# EAGLE design Rocketometer2148 LSM330DLC (EAGLE 6.2)
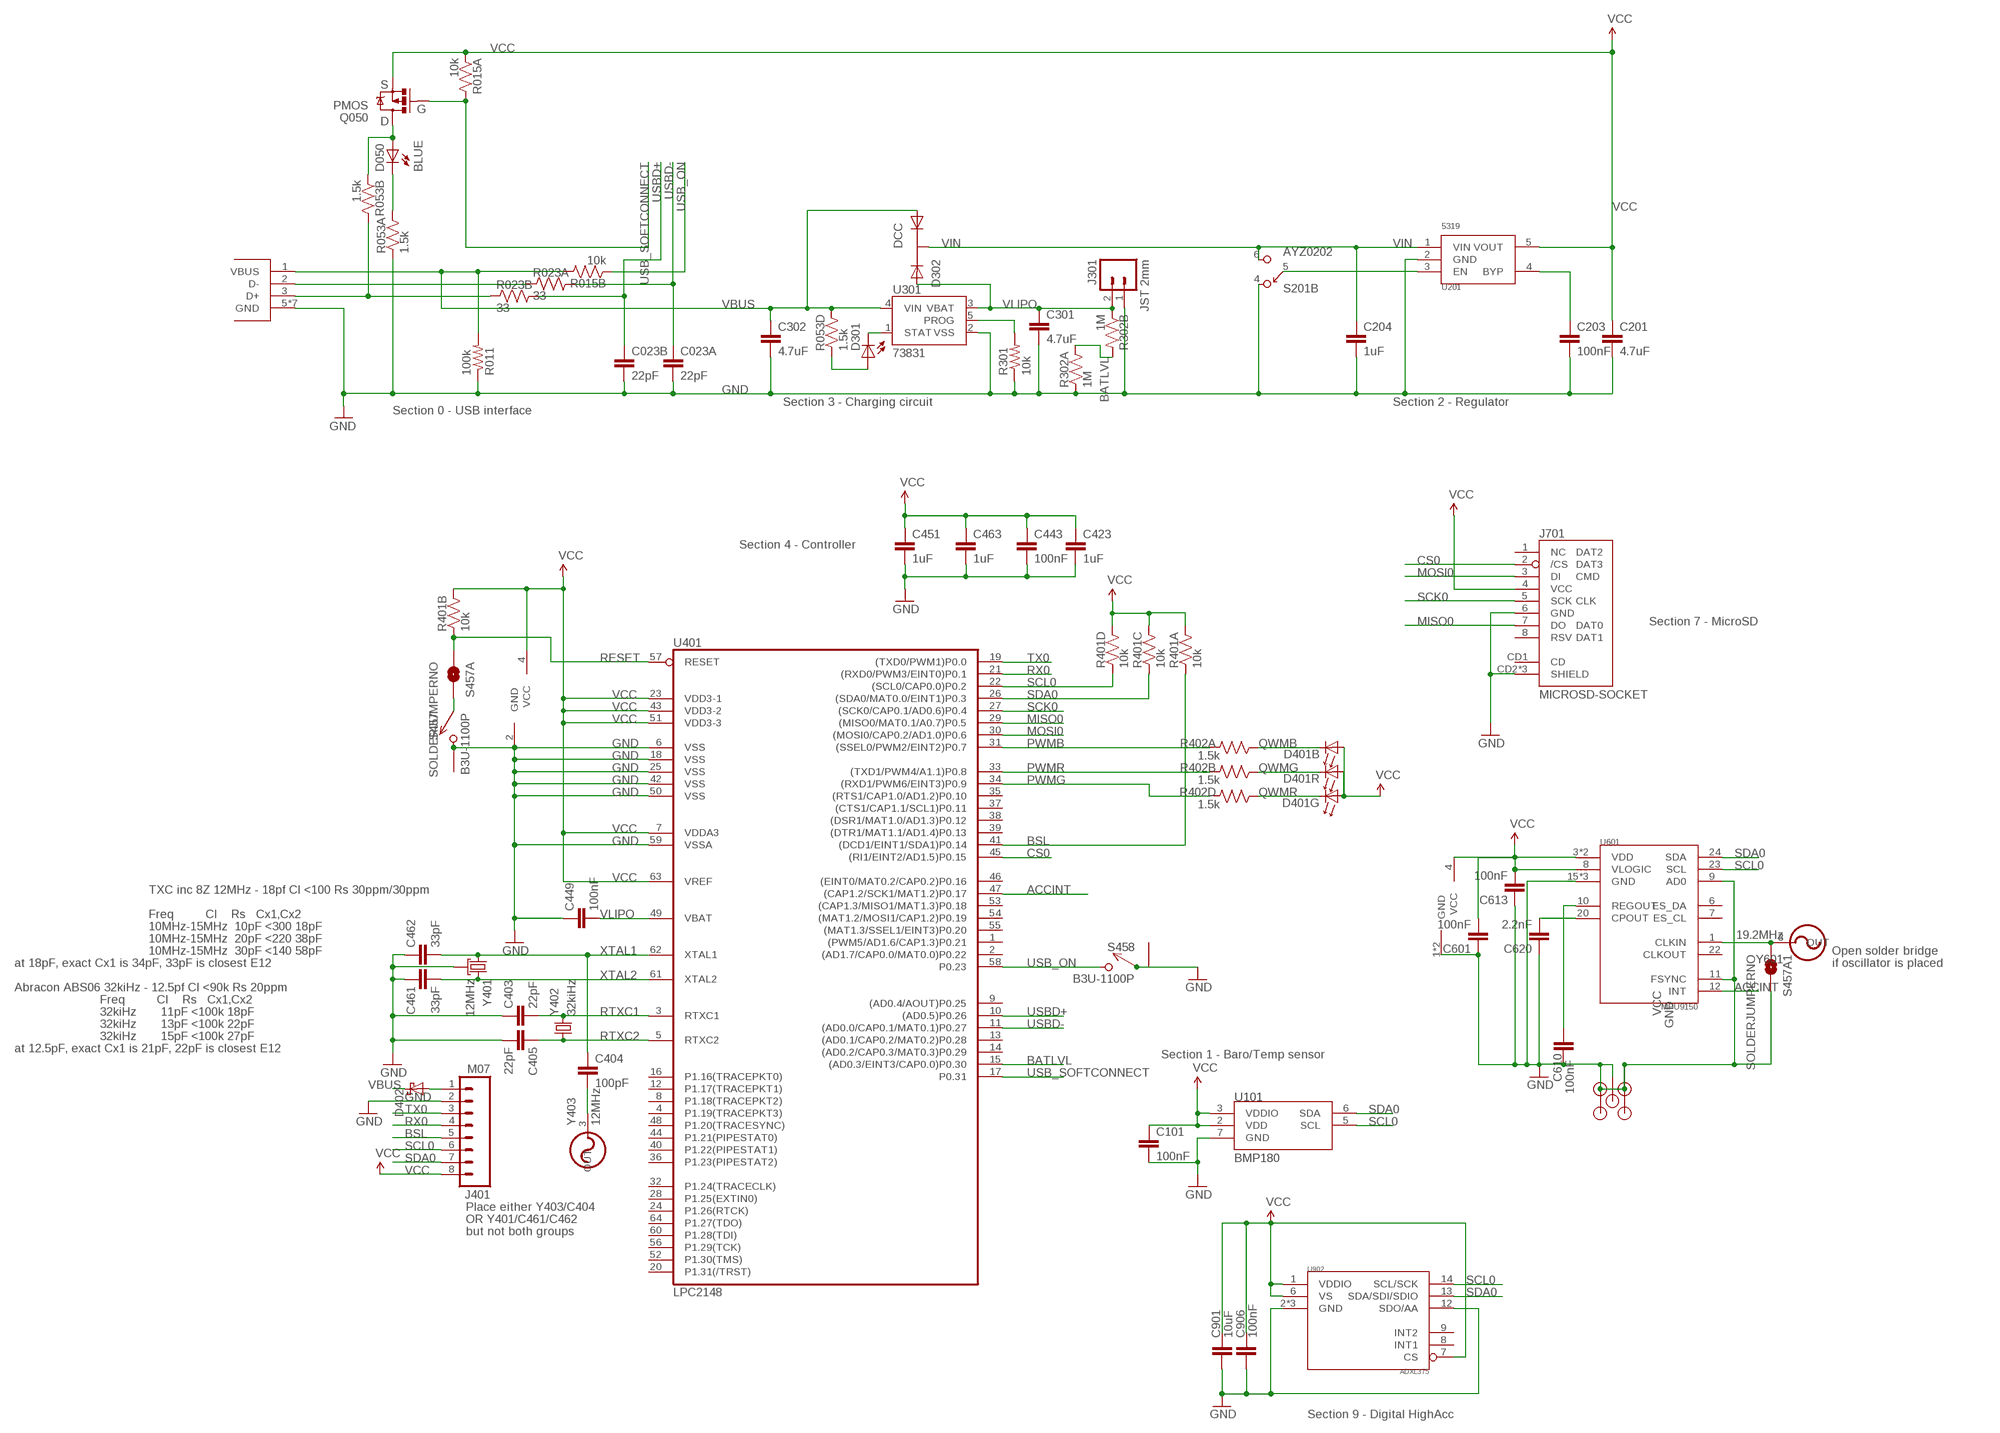
[diagram p0: schematic, sheet 1]

## Parts
C023  22pF  CKCM25  [CKCM25]
C101  100nF  CAP0402-CAP  [0402-CAP]
C201  4.7uF  CAP0402-CAP  [0402-CAP]
C203  100nF  CAP0402-CAP  [0402-CAP]
C204  1uF  CAP0402-CAP  [0402-CAP]
C301  4.7uF  CAP0402-CAP  [0402-CAP]
C302  4.7uF  CAP0402-CAP  [0402-CAP]
C403  22pF  CAP0402-CAP  [0402-CAP]
C404  100pF  CAP0402-CAP  [0402-CAP]
C405  22pF  CAP0402-CAP  [0402-CAP]
C423  1uF  CAP0402-CAP  [0402-CAP]
C443  100nF  CAP0402-CAP  [0402-CAP]
C449  100nF  CAP0402-CAP  [0402-CAP]
C451  1uF  CAP0402-CAP  [0402-CAP]
C461  33pF  CAP0402-CAP  [0402-CAP]
C462  33pF  CAP0402-CAP  [0402-CAP]
C463  1uF  CAP0402-CAP  [0402-CAP]
C601  100nF  CAP0402-CAP  [0402-CAP]
C610  100nF  CAP0402-CAP  [0402-CAP]
C613  100nF  CAP0402-CAP  [0402-CAP]
C620  2.2nF  CAP0402-CAP  [0402-CAP]
C901  10uF  CAP0603-CAP  [0603-CAP]
C906  100nF  CAP0402-CAP  [0402-CAP]
D050  BLUE  LED0603  [LED-0603]
D301  YELLOW  LED0603  [LED-0603]
D302  DCC  PMEG2005CT  [SOT-23-3]
D401  SMLP36RGB2W(R)  [SMLP36]
D402  DIODE_SCHOTTKY  [D0603]
J001  USB_MICROB_JSTGCT  [USB_MICROB_3075]
J301  JST 2mm  M02-JST-2MM-SMT  [JST-2-SMD]
J401  M07  M081X08  [1X08]
J701  MICROSD-SOCKET  [MICROSD-SOCKET-PP]
JP1  STANDOFF  [STANDOFF]
JP2  STANDOFF  [STANDOFF]
JP3  STANDOFF  [STANDOFF]
JP4  STANDOFF  [STANDOFF]
JP5  STANDOFF  [STANDOFF]
Q050  PMOS  MOSFET-PCHANNELSMD  [SOT23-3]
R011  100k  RESISTOR0402-RES  [0402-RES]
R015  10k  RP2EXB24V  [CRA02]
R023  33  RP2EXB24V  [CRA02]
R053  1.5k  RP404  [CRA04]
R301  10k  RESISTOR0402-RES  [0402-RES]
R302  1M  RP2EXB24V  [CRA02]
R401  10k  RP404  [CRA04]
R402  1.5k  RP404  [CRA04]
S201  AYZ0202  [AYZ0202]
S457  B3U-1100P  [B3U-1100P]
S457A  SOLDERJUMPERNO  [SJ_2S-NO]
S457A1  SOLDERJUMPERNO  [SJ_2S-NO]
S458  B3U-1100P  [B3U-1100P]
U101  BMP180  [BMP180]
U201  5319  MIC5319D5  [SOT-23-5]
U301  73831  MCP73831  [SOT23-5]
U401  LPC2148  LPC213X  [SQFP-S-10X10-64]
U601  MPU9150  [LLGA24]
U902  ADXL375  [ADXL375]
Y401  12MHz  CX2520  [CRYSTAL_SMD_2MM_2_5MM]
Y402  32kiHz  ABS06  [ABS06]
Y403  12MHz  OSCILLATORE35MT  [CRYSTAL_SMD_5MM_3_2MM]
Y601  19.2MHz  OSCILLATORASDMB  [CRYSTAL_SMD_2MM_2_5MM]

## Nets
ACCINT: U401.47((CAP1.2/SCK1/MAT1.2)P0.17) U601.12(INT)
BATLVL: R302.3 R302.4 U401.15((AD0.3/EINT3/CAP0.0)P0.30)
BSL: J401.5 R401.1 U401.41((DCD1/EINT1/SDA1)P0.14)
CONN_D+: J001.3(D+) R023.2 R053.7
CONN_D-: J001.2(D-) R023.1
CS0: J701.2(/CS) U401.45((RI1/EINT2/AD1.5)P0.15)
EN: S201.5 U201.3(EN)
GND [power]: C023.3 C023.4 C101.2 C201.2 C203.2 C204.2 C301.2 C302.2 C403.1 C405.2 C423.2 C443.2 C449.1 C451.2 C461.1 C462.1 C463.2 C601.1 C610.2 C613.1 C620.1 C901.2 C906.2 J001.5(GND) J001.P$1(GND) J001.P$2(GND) J001.P$3(GND) J001.P$4(GND) J001.P$8(GND) J001.P$10(GND) J301.1 J401.2 J701.6(GND) J701.CD2(SHIELD) J701.GND1(SHIELD) J701.GND3(SHIELD) JP1.P$1 JP2.P$1 JP3.P$1 JP4.P$1 JP5.P$1 R011.1 R053.1 R301.1 R302.1 S201.4 S457.P$2 S457.P$3 S457A1.2 S458.P$1 S458.P$3 U101.7(GND) U201.2(GND) U301.2(VSS) U401.6(VSS) U401.18(VSS) U401.25(VSS) U401.42(VSS) U401.50(VSS) U401.59(VSSA) U601.9(AD0) U601.11(FSYNC) U601.15(GND) U601.17(GND) U601.18(GND) U902.2(GND) U902.4(GND) U902.5(GND) U902.12(SDO/AA) Y401.2(GND) Y401.4(GND) Y403.2(GND) Y601.1(GND) Y601.2(GND)
MISO0: J701.7(DO) U401.29((MISO0/MAT0.1/A0.7)P0.5)
MOSI0: J701.3(DI) U401.30((MOSI0/CAP0.2/AD1.0)P0.6)
N$1: C620.2 U601.20(CPOUT)
N$2: R301.2 U301.5(PROG)
N$3: D301.A R053.4
N$4: D301.C U301.1(STAT)
N$5: C404.2 Y403.3(OUT)
N$6: D050.A Q050.3(D) R053.2
N$7: D050.C R053.8
N$8 [power]: D402.A J401.1
N$9 [power]: S457.P$1 S457A.2
N$13: C610.1 U601.10(REGOUT)
N$17: C203.1 U201.4(BYP)
OSC_9DOF: S457A1.1 U601.1(CLKIN) Y601.3(OUT)
PWMB: R402.8 U401.31((SSEL0/PWM2/EINT2)P0.7)
PWMG: R402.5 U401.34((RXD1/PWM6/EINT3)P0.9)
PWMR: R402.7 U401.33((TXD1/PWM4/A1.1)P0.8)
QWMB: D401.1(B:C) R402.1
QWMG: D401.5(G:C) R402.4
QWMR: D401.3(R:C) R402.2
RESET [power]: R401.2 S457A.1 U401.57(RESET)
RTXC1: C403.2 U401.3(RTXC1) Y402.2
RTXC2: C405.1 U401.5(RTXC2) Y402.1
RX0: J401.4 U401.21((RXD0/PWM3/EINT0)P0.1)
SCK0: J701.5(SCK) U401.27((SCK0/CAP0.1/AD0.6)P0.4)
SCL0: J401.6 R401.4 U101.5(SCL) U401.22((SCL0/CAP0.0)P0.2) U601.23(SCL) U902.14(SCL/SCK)
SDA0: J401.7 R401.3 U101.6(SDA) U401.26((SDA0/MAT0.0/EINT1)P0.3) U601.24(SDA) U902.13(SDA/SDI/SDIO)
TX0: J401.3 U401.19((TXD0/PWM1)P0.0)
USB_ON: R015.2 S458.P$2 U401.58(P0.23)
USB_SOFTCONNECT: Q050.1(G) R015.4 U401.17(P0.31)
USBD+: C023.2 R023.3 U401.10((AD0.5)P0.26)
USBD-: C023.1 R023.4 U401.11((AD0.0/CAP0.1/MAT0.1)P0.27)
VBUS [power]: C302.1 D302.1(A1) D402.C(K) J001.1(VBUS) R011.2 R015.3 R053.5 U301.4(VIN)
VCC [power]: C101.1 C201.1 C423.1 C443.1 C451.1 C463.1 C601.2 C613.2 C901.1 C906.1 D401.2(B:A) D401.4(R:A) D401.6(G:A) J401.8 J701.4(VCC) Q050.2(S) R015.1 R401.5 R401.6 R401.7 R401.8 U101.2(VDD) U101.3(VDDIO) U201.5(VOUT) U401.7(VDDA3) U401.23(VDD3-1) U401.43(VDD3-2) U401.51(VDD3-3) U401.63(VREF) U601.3(VDD) U601.8(VLOGIC) U601.13(VDD) U902.1(VDDIO) U902.6(VS) U902.7(CS) Y403.4(VCC) Y601.4(VCC)
VIN: C204.1 D302.3(K) S201.6 U201.1(VIN)
VLIPO [power]: C301.1 C449.2 D302.2(A2) J301.2 R302.2 U301.3(VBAT) U401.49(VBAT)
XTAL1: C404.1 C462.2 U401.62(XTAL1) Y401.1
XTAL2: C461.2 U401.61(XTAL2) Y401.3
Unconnected: J701.1(NC) J701.8(RSV) J701.CD1(CD) R053.3 R053.6 R402.3 R402.6 S201.1 S201.2 S201.3 U401.1((PWM5/AD1.6/CAP1.3)P0.21) U401.2((AD1.7/CAP0.0/MAT0.0)P0.22) U401.4(P1.19(TRACEPKT3)) U401.8(P1.18(TRACEPKT2)) U401.9((AD0.4/AOUT)P0.25) U401.12(P1.17(TRACEPKT1)) U401.13((AD0.1/CAP0.2/MAT0.2)P0.28) U401.14((AD0.2/CAP0.3/MAT0.3)P0.29) U401.16(P1.16(TRACEPKT0)) U401.20(P1.31(/TRST)) U401.24(P1.26(RTCK)) U401.28(P1.25(EXTIN0)) U401.32(P1.24(TRACECLK)) U401.35((RTS1/CAP1.0/AD1.2)P0.10) U401.36(P1.23(PIPESTAT2)) U401.37((CTS1/CAP1.1/SCL1)P0.11) U401.38((DSR1/MAT1.0/AD1.3)P0.12) U401.39((DTR1/MAT1.1/AD1.4)P0.13) U401.40(P1.22(PIPESTAT1)) U401.44(P1.21(PIPESTAT0)) U401.46((EINT0/MAT0.2/CAP0.2)P0.16) U401.48(P1.20(TRACESYNC)) U401.52(P1.30(TMS)) U401.53((CAP1.3/MISO1/MAT1.3)P0.18) U401.54((MAT1.2/MOSI1/CAP1.2)P0.19) U401.55((MAT1.3/SSEL1/EINT3)P0.20) U401.56(P1.29(TCK)) U401.60(P1.28(TDI)) U401.64(P1.27(TDO)) U601.6(ES_DA) U601.7(ES_CL) U601.22(CLKOUT) U902.8(INT1) U902.9(INT2)

## Notes on the sheet
- S
- G
- D
- Section 0 - USB interface | Section 3 - Charging circuit | Section 2 - Regulator
- Section 4 - Controller
- Section 7 - MicroSD
- TXC inc 8Z 12MHz - 18pf Cl <100 Rs 30ppm/30ppm
- Freq         Cl    Rs   Cx1,Cx2
- 10MHz-15MHz  10pF <300 18pF
- 10MHz-15MHz  20pF <220 38pF
- 10MHz-15MHz  30pF <140 58pF | Open solder bridge
- at 18pF, exact Cx1 is 34pF, 33pF is closest E12 | if oscillator is placed
- Abracon ABS06 32kiHz - 12.5pf Cl <90k Rs 20ppm
- Freq         Cl    Rs   Cx1,Cx2
- 32kiHz       11pF <100k 18pF
- 32kiHz       13pF <100k 22pF
- 32kiHz       15pF <100k 27pF
- at 12.5pF, exact Cx1 is 21pF, 22pF is closest E12
- Section 1 - Baro/Temp sensor
- Place either Y403/C404
- OR Y401/C461/C462
- but not both groups
- Section 9 - Digital HighAcc

## Library data of the parts
C023 = KwanSystems:CKC; DIGIKEY: 445-1860-1-ND
C101 C203 C443 C449 C601 C610 C613 = SparkFun:CAP: Capacitor Standard 0603 ceramic capacitor, and 0.1" leaded capacitor.; DIGIKEY: 445-1265-1-ND
C201 C301 C302 = SparkFun:CAP: Capacitor Standard 0603 ceramic capacitor, and 0.1" leaded capacitor.; DIGIKEY: 445-7395-1-ND
C204 C423 C451 C463 = SparkFun:CAP: Capacitor Standard 0603 ceramic capacitor, and 0.1" leaded capacitor.; DIGIKEY: 445-4114-1-ND
C403-C405 = SparkFun:CAP: Capacitor Standard 0603 ceramic capacitor, and 0.1" leaded capacitor.; DIGIKEY: 445-1239-1-ND
C461 C462 = SparkFun:CAP: Capacitor Standard 0603 ceramic capacitor, and 0.1" leaded capacitor.; DIGIKEY: 445-1241-1-ND
C620 = SparkFun:CAP: Capacitor Standard 0603 ceramic capacitor, and 0.1" leaded capacitor.; DIGIKEY: 445-1257-1-ND
C901 = SparkFun:CAP: Capacitor Standard 0603 ceramic capacitor, and 0.1" leaded capacitor.; DIGIKEY: 445-7486-1-ND
C906 = SparkFun-Passives:CAP: Capacitor Standard 0603 ceramic capacitor, and 0.1" leaded capacitor.; DIGIKEY: 445-1265-1-ND
D050 = SparkFun:LED: LEDs Standard schematic elements and footprints for 5mm, 3mm, 1206, and 0603 sized LEDs. 5mm - Spark Fun Electronics SKU : COM-00529 (and others); DIGIKEY: 350-2037-1-ND
D301 = SparkFun:LED: LEDs Standard schematic elements and footprints for 5mm, 3mm, 1206, and 0603 sized LEDs. 5mm - Spark Fun Electronics SKU : COM-00529 (and others); DIGIKEY: 350-2032-1-ND
D302 = KwanSystems:PMEG2005CT; DIGIKEY: 568-6500-1-ND
D401 = KwanSystems:SMLP36RGB2W(R); DIGIKEY: 846-1097-1-ND
D402 = KwanSystems:DIODE_SCHOTTKY
J001 = KwanSystems:USB_MICROB_JST; DIGIKEY: 609-4616-2-ND
J301 = SparkFun:M02: Header 2 Standard 2-pin 0.1" header. Use with straight break away headers (SKU : PRT-00116), right angle break away headers (PRT-00553), swiss pins (PRT-00743), machine pins (PRT-00117), and female headers (PRT-00115). Molex polarized connector foot print use with SKU : PRT-08233 with associated crimp pins and housings.; DIGIKEY: 455-1749-1-ND
J401 = SparkFun-Connectors:M08: Header 8 Standard 8-pin 0.1" header. Use with straight break away headers (SKU : PRT-00116), right angle break away headers (PRT-00553), swiss pins (PRT-00743), machine pins (PRT-00117), and female headers (PRT-00115).; DIGIKEY: $NOPART
J701 = KwanSystems:MICROSD-SOCKET: microSD Socket Push-push type uSD socket. Digikey 101-00660-68-6-1-ND. tDoc lines correctly indicate media card edge positions when inserting (unlocked, locked, depressed).; DIGIKEY: 101-00581-59-1-ND
JP1-JP5 = KwanSystems:STANDOFF; DIGIKEY: $NOPART
Q050 = SparkFun:MOSFET-PCHANNEL; DIGIKEY: NTR1P02T1GOSCT-ND
R011 = SparkFun:RESISTOR: Resistor Basic schematic elements and footprints for 0603, 1206, and PTH resistors.; DIGIKEY: P100KLCT-ND
R015 = KwanSystems:RP2; DIGIKEY: Y5103CT-ND
R023 R302 = KwanSystems:RP2
R053 R402 = KwanSystems:RP4; DIGIKEY: CRA4S81.5KCT-ND
R301 = SparkFun:RESISTOR: Resistor Basic schematic elements and footprints for 0603, 1206, and PTH resistors.; DIGIKEY: P10.0KLCT-ND
R401 = KwanSystems:RP4; DIGIKEY: CRA4S810KCT-ND
S201 = KwanSystems:AYZ0202; DIGIKEY: 401-2013-1-ND
S457 S458 = KwanSystems:B3U-1100P; DIGIKEY: SW1021CT-ND
S457A S457A1 = SparkFun-Passives:SOLDERJUMPER: Solder Jumper Standard SMD solder jumper. Used to automate production. Two varients : Normally Open and Normally Closed are the same, but have different paste layers. NC will have a large amount of paste and should jumper during reflow.; DIGIKEY: $NOPART
U101 = KwanSystems:BMP180; DIGIKEY: 828-1027-1-ND
U201 = KwanSystems:MIC5319; DIGIKEY: 576-1910-1-ND
U301 = SparkFun:MCP73831: Microchip's MCP73831 Miniature single cell, fully integrated Li-Ion, Li-polymer charge management controller http://ww1.microchip.com/downloads/en/DeviceDoc/21984a.pdf; DIGIKEY: MCP73831T-2ACI/OTCT-ND
U401 = SparkFun:LPC213X: LPC213x Schematic element and footprint for NXP LPC213x. Spark Fun Electronics SKU : COM-00520; DIGIKEY: 568-1765-ND
U601 = KwanSystems:MPU9150; DIGIKEY: $NOPART
U902 = KwanSystems:ADXL375; DIGIKEY: ADXL375BCCZ-ND
Y401 = KwanSystems:CX2520; DIGIKEY: 887-1487-1-ND
Y402 = KwanSystems:ABS06; DIGIKEY: 535-10104-1-ND
Y403 = KwanSystems:OSCILLATOR: EM53T temperature compensated oscillator (TCXO) This part contains a crystal and all the rest of the electronics needed to directly produce a clock signal. Temperature compensation means that the part maintains +-2ppm over a wide temperature range.; DIGIKEY: 631-1068-1-ND
Y601 = KwanSystems:OSCILLATOR: EM53T temperature compensated oscillator (TCXO) This part contains a crystal and all the rest of the electronics needed to directly produce a clock signal. Temperature compensation means that the part maintains +-2ppm over a wide temperature range.

## Net classes
0 default: width 0.152 mm, drill 0.33 mm, clearance 0.152 mm
1 power: width 0.152 mm, drill 0.33 mm, clearance 0.152 mm to class 0, clearance 0.152 mm
2 hv: width 0.152 mm, drill 0.33 mm, clearance 0.152 mm to class 0, clearance 0.152 mm to class 1, clearance 0.152 mm

## Board
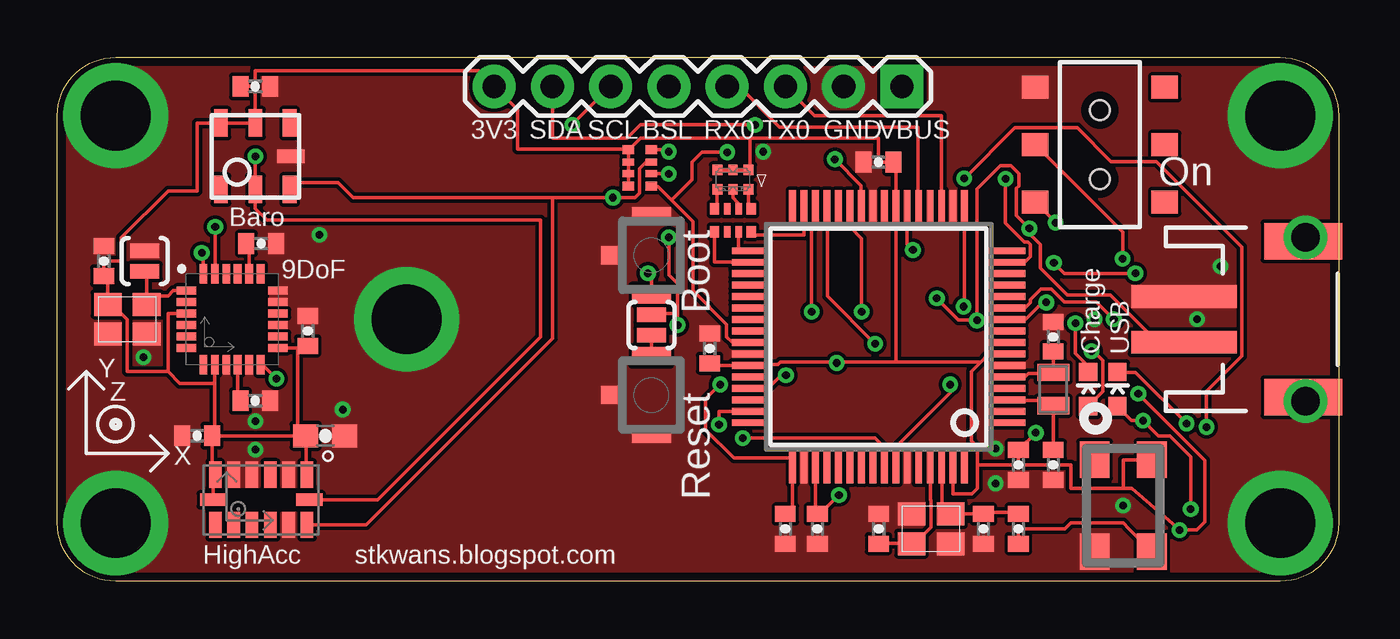
[diagram p1: board, top side]
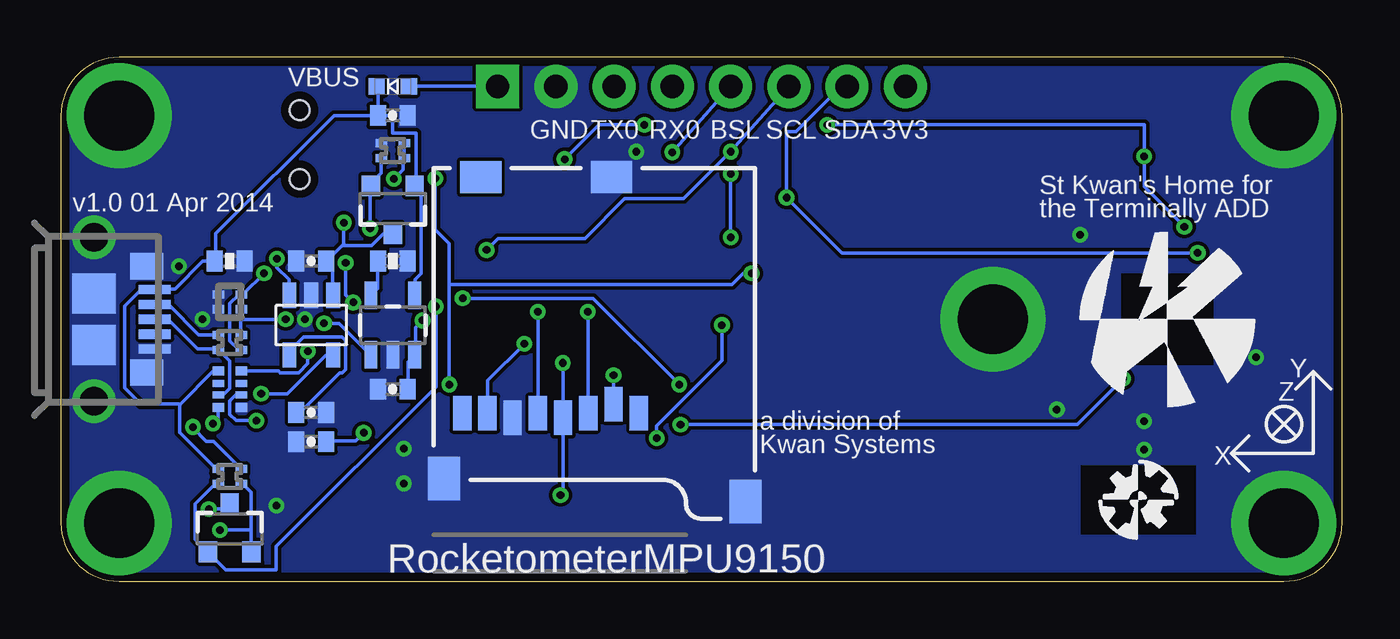
[diagram p2: board, bottom side, seen from below]

Size 55.88 x 22.86 mm. Coordinates in mm from the lower left corner, seen from the top.
Outline: 2.54,22.86 53.34,22.86 arc-90 55.88,20.32 55.88,2.54 arc-90 53.34,0 2.54,0 arc-90 0,2.54 0,20.32 arc-90 2.54,22.86
Copper layers (1*16): Top 0.0356mm / dielectric 1.5011mm / Bottom 0.0356mm
Design rules: minimum track width 6mil, minimum drill 13mil, track to track 6mil, track to pad 6mil, pad to pad 6mil, via to via 6mil, smd to smd 6mil, copper to edge 15mil, drill to drill 6mil, minimum pad ring 7mil, minimum via ring 7mil, stop-mask expansion 4mil, vias tented up to drill 14mil, thermal gap 10mil

### Footprints (pad centres in the part's own frame; a part is rotated, then mirrored left to right if it is on the bottom)
CKCM25 = smd 0.35 x 0.5: 1 -0.325,-0.5; 2 0.325,-0.5; 3 0.325,0.5; 4 -0.325,0.5
0402-CAP = smd 0.7 x 0.9: 1 -0.65,0; 2 0.65,0
0603-CAP = smd 1.1 x 1: 1 -0.85,0; 2 0.85,0
LED-0603 = smd 0.8 x 0.8: A 0,-0.75; C 0,0.75
SOT-23-3 = smd 0.9 x 0.8: 1 -1,0.95; 2 -1,-0.95; 3 1.1,0
SMLP36 = smd 0.45 x 0.45: 1 -0.675,0.425; 2 -0.675,-0.425; 5 0.675,0.425; 6 0.675,-0.425 | smd 0.4 x 0.45: 3 0,0.425; 4 0,-0.425
D0603 = smd 0.7 x 0.7: A -0.7,0; C 0.7,0
USB_MICROB_3075 = smd 0.4 x 1.4: 1 -1.3,4.1; 2 -0.65,4.1; 3 0,4.1; 4 0.65,4.1; 5 1.3,4.1 | smd 1.15 x 1.45: P$1 2.32,3.75; P$10 -2.32,3.75 | smd 1.75 x 1.9: P$2 1.125,1.45; P$8 -1.125,1.45 | drill 1.25 pad 1.9: P$3 -3.575,1.45; P$4 3.575,1.45
JST-2-SMD = smd 1 x 4.6: 1 -1,-3.7; 2 1,-3.7 | smd 1.6 x 3.4: NC1 -3.4,1.5; NC2 3.4,1.5
1X08 = drill 1.016 pad 1.88 square: 1 0,0 | drill 1.016 pad 1.88: 2 2.54,0; 3 5.08,0; 4 7.62,0; 5 10.16,0; 6 12.7,0; 7 15.24,0; 8 17.78,0
MICROSD-SOCKET-PP = smd 0.8 x 1.5: 1 -8.94,10.7; 2 -7.84,10.3; 3 -6.74,10.7; 4 -5.64,10.9; 5 -4.54,10.7; 6 -3.44,10.9; 7 -2.34,10.7; 8 -1.24,10.7 | smd 1.8 x 1.4: CD1 -2.05,0.4; CD2 -7.75,0.4 | smd 1.4 x 1.9: GND1 -13.6,14.55; GND3 -0.45,13.55
STANDOFF = drill 3.048 pad 4.572: P$1 0,0
SOT23-3 = smd 0.8 x 0.9: 1 -0.95,-1; 2 0.95,-1; 3 0,1.1
0402-RES = smd 0.7 x 0.9: 1 -0.65,0; 2 0.65,0
CRA02 = smd 0.35 x 0.5: 1 -0.325,-0.5; 2 0.325,-0.5; 3 0.325,0.5; 4 -0.325,0.5
CRA04 = smd 0.4 x 0.5: 1 -0.8,-0.5; 4 0.8,-0.5; 5 0.8,0.5; 8 -0.8,0.5 | smd 0.3 x 0.5: 2 -0.25,-0.5; 3 0.25,-0.5; 6 0.25,0.5; 7 -0.25,0.5
AYZ0202 = smd 1 x 1.15: 1 -2.5,2.825; 2 0,2.825; 3 2.5,2.825; 4 -2.5,-2.825; 5 0,-2.825; 6 2.5,-2.825 | hole 0.85: 1.5,0; -1.5,0
B3U-1100P = smd 0.8 x 1.7: P$1 -1.7,0; P$2 1.7,0 | smd 0.8 x 1.1: P$3 0,-1.65
SJ_2S-NO = smd 0.635 x 1.27: 1 -0.45,0; 2 0.45,0
BMP180 = smd 0.6 x 1.2: 1 1.5,1.45; 2 0,1.45; 3 -1.5,1.45; 4 -1.5,-1.45; 5 0,-1.45; 6 1.5,-1.45 | smd 1.2 x 0.6: 7 1.55,0
SOT-23-5 = smd 0.6 x 1.1: 1 -0.95,-1.3; 2 0,-1.3; 3 0.95,-1.3; 4 0.95,1.3; 5 -0.95,1.3
SOT23-5 = smd 0.55 x 1.2: 1 -0.95,-1.3; 2 0,-1.3; 3 0.95,-1.3; 4 0.95,1.3; 5 -0.95,1.3
SQFP-S-10X10-64 = smd 0.3 x 1.6: 1 -3.75,-5.6; 2 -3.25,-5.6; 3 -2.75,-5.6; 4 -2.25,-5.6; 5 -1.75,-5.6; 6 -1.25,-5.6; 7 -0.75,-5.6; 8 -0.25,-5.6; 9 0.25,-5.6; 10 0.75,-5.6; 11 1.25,-5.6; 12 1.75,-5.6; 13 2.25,-5.6; 14 2.75,-5.6; 15 3.25,-5.6; 16 3.75,-5.6; 33 3.75,5.6; 34 3.25,5.6; 35 2.75,5.6; 36 2.25,5.6; 37 1.75,5.6; 38 1.25,5.6; 39 0.75,5.6; 40 0.25,5.6; 41 -0.25,5.6; 42 -0.75,5.6; 43 -1.25,5.6; 44 -1.75,5.6; 45 -2.25,5.6; 46 -2.75,5.6; 47 -3.25,5.6; 48 -3.75,5.6 | smd 1.6 x 0.3: 17 5.6,-3.75; 18 5.6,-3.25; 19 5.6,-2.75; 20 5.6,-2.25; 21 5.6,-1.75; 22 5.6,-1.25; 23 5.6,-0.75; 24 5.6,-0.25; 25 5.6,0.25; 26 5.6,0.75; 27 5.6,1.25; 28 5.6,1.75; 29 5.6,2.25; 30 5.6,2.75; 31 5.6,3.25; 32 5.6,3.75; 49 -5.6,3.75; 50 -5.6,3.25; 51 -5.6,2.75; 52 -5.6,2.25; 53 -5.6,1.75; 54 -5.6,1.25; 55 -5.6,0.75; 56 -5.6,0.25; 57 -5.6,-0.25; 58 -5.6,-0.75; 59 -5.6,-1.25; 60 -5.6,-1.75; 61 -5.6,-2.25; 62 -5.6,-2.75; 63 -5.6,-3.25; 64 -5.6,-3.75
LLGA24 = smd 0.85 x 0.34: 1 -2,1.25; 2 -2,0.75; 3 -2,0.25; 4 -2,-0.25; 5 -2,-0.75; 6 -2,-1.25; 13 2,-1.25; 14 2,-0.75; 15 2,-0.25; 16 2,0.25; 17 2,0.75; 18 2,1.25 | smd 0.34 x 0.85: 7 -1.25,-1.975; 8 -0.75,-1.975; 9 -0.25,-1.975; 10 0.25,-1.975; 11 0.75,-1.975; 12 1.25,-1.975; 19 1.25,1.975; 20 0.75,1.975; 21 0.25,1.975; 22 -0.25,1.975; 23 -0.75,1.975; 24 -1.25,1.975
ADXL375 = smd 0.55 x 1.145: 1 2,1.097; 2 1.2,1.097; 3 0.4,1.097; 4 -0.4,1.097; 5 -1.2,1.097; 6 -2,1.097; 8 -2,-1.097; 9 -1.2,-1.097; 10 -0.4,-1.097; 11 0.4,-1.097; 12 1.2,-1.097; 13 2,-1.097 | smd 1.145 x 0.55: 7 -2.098,0; 14 2.098,0
CRYSTAL_SMD_2MM_2_5MM = smd 1.2 x 1: 1 -0.85,-0.65; 2 0.85,-0.65; 3 0.85,0.65; 4 -0.85,0.65
ABS06 = smd 0.75 x 1.4: 1 -0.725,0; 2 0.725,0
CRYSTAL_SMD_5MM_3_2MM = smd 1.6 x 1.3: 1 -2,-1.25; 2 2,-1.25; 3 2,1.25; 4 -2,1.25

### Placement (x,y rotation side)
C023  48.51,12.19 90 bottom
C101  8.64,21.59 0 top
C201  44.96,6.1 180 bottom
C203  44.96,7.37 0 bottom
C204  44.96,13.97 180 bottom
C301  41.4,8.38 180 bottom
C302  41.4,20.32 0 bottom
C403  43.43,5.08 90 top
C404  41.91,2.29 270 top
C405  43.43,10.67 90 top
C423  35.81,18.29 180 top
C443  28.45,10.16 90 top
C449  31.75,2.29 90 top
C451  33.15,2.29 270 top
C461  35.81,2.29 270 top
C462  40.39,2.29 90 top
C463  41.91,5.08 270 top
C601  2.03,13.97 270 top
C610  8.64,7.87 0 top
C613  10.92,10.92 270 top
C620  8.89,14.73 180 top
C901  11.68,6.35 0 top
C906  6.1,6.35 180 top
D050  46.23,8.38 0 top
D301  44.96,8.38 0 top
D302  41.4,16.26 270 bottom
D401  29.46,17.53 180 top
D402  41.4,21.59 180 bottom
J001  55.88,11.43 270 bottom
J301  52.83,11.43 270 top
J401  36.83,21.59 180 top
J701  39.62,18.03 180 bottom
JP1  2.54,2.54 0 top
JP2  2.54,20.32 0 top
JP3  15.24,11.43 0 top
JP4  53.34,2.54 0 top
JP5  53.34,20.32 0 top
Q050  48.51,2.29 0 bottom
R011  48.51,13.97 180 bottom
R015  48.51,4.57 90 bottom
R023  48.51,10.41 270 bottom
R053  48.51,8.38 90 bottom
R301  41.4,13.97 180 bottom
R302  41.4,18.8 270 bottom
R401  25.4,18.03 90 top
R402  29.46,15.75 180 top
S201  45.47,19.05 270 top
S457  25.91,8.13 270 top
S457A  25.91,11.18 270 top
S457A1  3.81,13.97 90 top
S458  25.91,14.22 270 top
U101  8.64,18.54 0 top
U201  44.96,11.18 180 bottom
U301  41.4,11.18 0 bottom
U401  35.81,10.67 90 top
U601  7.62,11.43 0 top
U902  8.89,3.56 0 top
U$4  [AXES]  1.27,5.59 0 top
U$5  [KWAN_ACC]  7.62,11.43 0 bottom
U$6  [OSHW_ACC]  8.89,3.56 0 bottom
Y401  38.1,2.29 180 top
Y402  43.43,8.38 270 top
Y403  46.48,3.3 270 top
Y601  3.05,11.43 0 top

### Tracks (layer width: path | path; a pad name or v marks a point on that pad's centre or on a via)
ACCINT  (via drill 0.33)
  Top 0.152: v9.55,8.84 8.94,9.45 8.89,9.45 U601.12 | U401.47 28.85,7.42 v28.85,6.83
  Bottom 0.152: v9.55,8.84 11.56,6.83 v28.85,6.83
BATLVL  (via drill 0.33)
  Top 0.152: v41.35,17.55 41.35,15.62 42.16,14.81 42.32,14.81 42.44,14.68 42.44,14.17 42.19,13.92 41.43,13.92 U401.15
  Bottom 0.152: R302.4 40.92,19.1 40.92,18.49 R302.3 40.95,18.41 40.95,17.96 v41.35,17.55
BSL  (via drill 0.33)
  Top 0.152: 26.78,16.62 27.71,15.7 27.71,12.68 29.18,11.2 29.18,10.67 29.41,10.44 30.2,10.44 U401.41 | 26.78,16.62 26.19,17.22 R401.1 | v29.21,18.72 28.12,18.72 27.69,18.29 27.69,17.53 26.78,16.62
  Bottom 0.152: v29.21,18.72 J401.5
CONN_D+
  Bottom 0.152: R053.7 49,8.15 48.77,8.15 48.51,8.41 48.51,9.6 49,10.08 R023.2 49.07,10.13 49.91,10.13 51.21,11.43 J001.3
CONN_D-
  Bottom 0.152: R023.1 49.02,10.74 49.86,10.74 51.18,12.06 51.77,12.06 J001.2
CS0  (via drill 0.33)
  Top 0.152: v31.77,8.99 31.57,8.99 31.01,8.43 30.23,8.43 U401.45
  Bottom 0.152: v31.77,8.99 31.77,7.75 J701.2
EN  (via drill 0.33)
  Top 0.152: v46.46,14.07 46.46,15.24 S201.5
  Bottom 0.152: v46.46,14.07 46.46,13.69 45.92,13.16 45.92,12.5 U201.3
GND  (via drill 0.33)
  other vias: 45.24,11.43 49.71,11.43 50.72,13.74 30.78,18.75 8.64,6.99 3.76,9.78 12.45,7.49 40.92,5.79 11.43,15.11 8.64,5.74 40.92,4.27 46.48,3.3
  pour Bottom (no thermals): 2.54,22.86 53.34,22.86 arc-90 55.88,20.32 55.88,2.54 arc-90 53.34,0 2.54,0 arc-90 0,2.54 0,20.32 arc-90
  pour Top (no thermals): 2.54,22.86 53.34,22.86 arc-90 55.88,20.32 55.88,2.54 arc-90 53.34,0 2.54,0 arc-90 0,2.54 0,20.32 arc-90
MISO0  (via drill 0.33)
  Top 0.152: v35.66,10.36 33.58,12.45 33.58,16.26 U401.29
  Bottom 0.152: v35.66,10.36 37.26,8.76 37.26,7.34 J701.7
MOSI0  (via drill 0.33)
  Top 0.152: v32.89,11.76 32.89,15.32 33.05,15.47 33.05,16.26 U401.30
  Bottom 0.152: v32.89,11.76 32.89,7.34 J701.3
N$1
  Top 0.152: U601.20 8.36,13.41 8.36,14.63 8.26,14.73 C620.2
N$2
  Bottom 0.152: R301.2 42.06,13.97 42.06,12.78 42.34,12.5 U301.5
N$3  (via drill 0.33)
  Top 0.152: v45.11,10.03 45.19,10.03 45.59,9.63 45.59,8.28 44.96,7.64 D301.A
  Bottom 0.152: v45.11,10.03 45.11,9.5 45.52,9.09 46.3,9.09 46.38,9.17 R053.4
N$4  (via drill 0.33)
  Top 0.152: D301.C 44.96,9.37 44.4,9.93 v44.4,11.25
  Bottom 0.152: v44.4,11.25 43.74,11.25 42.37,9.88 U301.1
N$5
  Top 0.152: 41.91,1.65 C404.2 41.91,2.29 43.94,2.29 44.2,2.54 46.48,2.54 46.74,2.29 47.12,1.91 47.48,1.54 Y403.3
N$6  (via drill 0.33)
  Top 0.152: D050.A 46.84,7.01 v47.35,7.01 48.01,6.35 48.51,6.35 49.43,5.44 v49.43,3.15
  Bottom 0.152: v47.35,7.01 48.23,7.01 48.51,7.29 48.51,7.87 48.26,8.13 48.03,8.13 R053.2 | v49.43,3.15 48.51,3.15 Q050.3
N$7  (via drill 0.33)
  Top 0.152: v49.25,6.88 47.02,9.12 46.23,9.12 D050.C
  Bottom 0.152: v49.25,6.88 49.02,7.11 49.02,7.57 R053.8
N$8
  Bottom 0.152: D402.A J401.1
N$9
  Top 0.152: S457.P$1 S457A.2
N$13
  Top 0.152: U601.10 7.87,7.98 7.98,7.87 C610.1
N$17
  Bottom 0.152: C203.1 45.44,7.37 43.71,9.09 43.61,9.09 43.46,9.25 43.46,10.52 43.61,10.67 45.29,10.67 45.9,10.06 45.9,9.88 U201.4
OSC_9DOF
  Top 0.152: U601.1 5.05,12.68 4.83,12.45 4.26,12.45 Y601.3 3.9,13.35 S457A1.1
PWMB
  Top 0.152: U401.31 32.56,15.11 30.4,15.11 R402.8
PWMG
  Top 0.152: U401.34 28.66,13.92 R402.5
PWMR
  Top 0.152: U401.33 29.71,14.42 R402.7
QWMB
  Top 0.152: D401.1 30.15,16.36 R402.1
QWMG
  Top 0.152: D401.5 28.78,17.09 28.78,16.36 28.68,16.26 R402.4
QWMR
  Top 0.152: D401.3 29.46,16.74 29.69,16.51 29.69,16.26 R402.2
RESET  (via drill 0.33)
  Top 0.152: v26.67,17.78 R401.2 | v26.67,15.01 26.67,13.36 27.05,12.98 27.05,11.68 | S457A.1 25.97,11.68 27.05,11.68 | v29.9,6.25 35.66,6.25 36.04,5.87 36.04,5.08 U401.57 | 27.05,11.68 v27.05,11.18
  Bottom 0.152: v26.67,15.01 v26.67,17.78 | v29.9,6.25 29.9,6.78 27.05,9.63 v27.05,11.18
RTXC1
  Top 0.152: C403.2 Y402.2 43.38,7.7 43.18,7.9 41.43,7.9 U401.3
RTXC2
  Top 0.152: C405.1 Y402.1 43.38,9.07 42.34,9.07 42.22,8.94 41.43,8.94 U401.5
RX0
  Top 0.152: U401.21 37.54,16.28 37.54,19.81 31.5,19.81 29.72,21.59 J401.4
SCK0  (via drill 0.33)
  Top 0.152: v35.08,11.76 35.08,14.96 34.57,15.47 34.57,16.26 U401.27
  Bottom 0.152: v35.08,11.76 J701.5
SCL0  (via drill 0.33)
  Top 0.152: v6.88,15.47 6.88,13.41 U601.23 | v26.67,18.75 26.59,18.82 R401.4 | U401.22 37.06,16.26 37.06,14.71 v37.31,14.45 | J401.6 v22.45,19.91 | v8.64,18.54 U101.5 8.64,16.26 9.14,15.75 21.08,15.75 21.08,10.67 13.97,3.56 U902.14
  Bottom 0.152: J401.6 v26.67,18.75 28.73,16.69 31.29,16.69 33.02,14.96 36.8,14.96 v37.31,14.45 | v22.45,19.91 8.64,19.91 v8.64,18.54 8.64,17.22 v6.88,15.47
SDA0  (via drill 0.33)
  Top 0.152: R401.3 25.88,18.26 25.65,18.26 25.4,18.01 25.4,16.94 25.2,16.74 v24.23,16.74 21.59,16.74 | v6.3,14.33 6.35,14.28 6.35,13.41 U601.24 | U902.13 13.46,2.46 21.59,10.59 21.59,16.74 | v33.91,18.41 35.05,17.27 U401.26 | v30.43,19.91 25.43,19.91 24.84,19.33 21.59,19.33 J401.7 | U101.6 10.14,17.4 12.24,17.4 12.9,16.74 21.59,16.74
  Bottom 0.152: v6.3,14.33 21.82,14.33 v24.23,16.74 24.23,19.61 23.82,19.61 21.84,21.59 J401.7 | v30.43,19.91 32.41,19.91 v33.91,18.41
TX0
  Top 0.152: U401.19 38.56,20.32 33.02,20.32 J401.3
USB_ON  (via drill 0.33)
  Top 0.152: v50.11,6.73 50.11,8.28 51.66,9.83 51.66,14.58 47.93,18.31 45.95,18.31 44.48,19.79 41.76,19.79 v39.55,17.58 | v38.94,8.59 38.94,8.23 36.58,5.87 36.58,5.08 U401.58 | S458.P$2 25.91,13.28 v25.76,13.44
  Bottom 0.152: v39.55,17.58 39.55,15.34 38.94,14.73 38.94,12.95 | v38.94,8.59 38.94,12.95 | v25.76,13.44 26.14,13.44 26.62,12.95 38.94,12.95 | v50.11,6.73 50.11,6.68 49.53,6.1 49.21,6.1 R015.2
USB_SOFTCONNECT  (via drill 0.33)
  Top 0.152: v39.52,11.99 39.55,12.01 39.55,16.26 U401.17
  Bottom 0.152: R015.4 49.02,4.24 49.15,4.24 50.01,3.38 50.01,1.83 Q050.1 | 49.48,1.04 Q050.1 | v39.52,11.99 39.52,8.48 46.48,1.52 46.48,0.51 48.69,0.51 Q050.1
USBD+  (via drill 0.33)
  Top 0.152: v47.02,13.44 43.92,13.44 v43.46,13.89 | v43.13,12.17 42.95,12.17 42.22,11.43 41.43,11.43 U401.10
  Bottom 0.152: R023.3 48.03,10.11 48.13,10.11 48.51,10.49 48.51,12.12 48.13,12.5 48.03,12.5 C023.2 47.95,12.55 47.9,12.55 v47.02,13.44 | v43.46,13.89 43.46,12.5 v43.13,12.17
USBD-  (via drill 0.33)
  Top 0.152: v46.08,11.43 45.31,12.19 43.92,12.19 43.36,12.75 42.9,12.75 42.44,12.29 42.44,12.17 42.22,11.94 41.43,11.94 U401.11
  Bottom 0.152: 48.03,11.43 48.03,11.86 C023.1 | 48.03,11.43 48.03,10.74 R023.4 | v46.08,11.43 48.03,11.43
VBUS
  Bottom 0.152: 50.7,7.7 50.7,6.5 49.02,4.83 49.01,4.83 R015.3 | 50.7,7.7 49.23,9.17 49.02,9.17 R053.5 | 50.7,7.7 50.75,7.75 52.4,7.75 53.09,8.43 53.09,12.01 52.4,12.7 51.84,12.7 J001.1 51.77,12.75 50.9,12.75 49.68,13.97 R011.2 49.12,14.02 49.12,15.16 43.97,20.32 C302.1 | 40.44,17.27 D302.1 | U301.4 40.44,12.5 40.44,13.16 40.16,13.44 40.16,16.94 40.41,17.2 D302.1 | D402.C 42.05,21.59 C302.1 | C302.1 41.4,20.32 41.4,19.56 40.39,19.56 40.39,17.26 D302.1
VCC  (via drill 0.33)
  Top 0.152: v47.14,8.18 50.04,5.28 50.04,2.59 49.68,2.23 v48.95,2.23 46.86,4.06 46.48,4.06 | 33.07,5.05 U401.51 33.06,2.94 C451.1 33.26,2.94 v34.09,3.76 | C463.1 | 40.23,9.53 39.85,9.14 39.85,6.12 40.13,5.84 40.13,5.08 | 40.23,9.53 40.62,9.91 41.4,9.91 U401.7 | 36.58,9.58 40.18,9.58 40.23,9.53 | 36.58,9.58 33.98,9.58 | 33.98,9.58 31.55,9.58 31.42,9.45 30.28,9.45 U401.43 28.45,9.42 C443.1 | v33.98,9.53 33.98,9.58 | v42.67,6.48 41.96,5.77 C463.1 | 36.47,18.29 C423.1 | R401.8 24.92,17.25 24.92,17.78 R401.7 24.92,17.86 24.92,18.26 R401.6 24.92,18.34 24.92,18.82 R401.5 | D401.6 28.8,17.93 29.46,17.93 D401.4 29.52,17.93 30.12,17.93 D401.2 | 30.2,17.91 D401.2 | R401.5 24.84,18.85 20.07,18.85 20.07,20.57 J401.8 18.36,22.28 8.64,22.28 8.64,21.59 | 36.27,18.31 36.4,18.31 C423.1 | 30.2,19.33 25.43,19.33 24.97,18.87 R401.5 | 30.2,19.33 35.81,19.33 35.81,18.29 C423.1 | 6.86,8.64 6.86,6.45 C906.1 | 6.86,8.64 6.86,9.45 U601.8 | 10.49,10.19 11.1,10.19 11.18,10.26 C613.2 | 10.49,10.19 U601.13 | C901.1 10.85,6.35 10.85,4.7 10.87,4.67 U902.1 | C901.1 10.79,6.4 10.49,6.71 10.49,10.19 | 7.87,21.59 C101.1 | U902.7 6.81,3.56 6.81,4.65 U902.6 | U902.6 | 7.92,21.64 C101.1 | 30.2,19.33 30.2,17.95 D401.2 | U601.3 4.83,11.68 4.83,9.14 | 4.83,9.14 5.33,8.64 6.86,8.64 | C906.1 | C906.1 C901.1 | 36.58,9.58 36.58,16.27 U401.23 36.56,18.19 C423.1 | 40.13,5.08 40.13,4.06 39.88,3.81 39.06,3.81 U401.63 | C463.1 41.91,5.08 | 41.91,5.08 40.13,5.08 | 8.64,21.59 U101.2 U101.3 6.1,19.99 6.1,17.02 4.83,17.02 2.79,14.99 2.79,13.97 2.03,13.97 C601.2 2.2,13.21 Y601.4 2.4,12.08 3.05,11.43 3.05,9.14 4.83,9.14 | C101.1 8.64,21.59 | C906.1 6.76,4.65 U902.6
  Top 0.152: 41.91,5.08 44.2,5.08 44.2,4.06 46.48,4.06 | Y403.4 46.48,5.3 46.48,4.06
  Bottom 0.152: 47.57,2.23 47.57,1.04 Q050.2 | 47.57,2.23 47.57,3.89 48.01,4.32 R015.1 | 44.32,6.1 C201.1 44.25,6.12 43.03,6.12 v42.67,6.48 | v47.14,8.18 46,8.18 44.32,9.86 44.02,9.86 U201.5 | v48.95,2.23 47.57,2.23 | v34.09,3.76 33.98,3.86 33.98,7.11 J701.4 33.98,7.19 v33.98,9.53
VIN  (via drill 0.33)
  Top 0.152: v43.54,15.65 42.65,16.54 S201.6
  Bottom 0.152: 43.54,14.66 43.61,14.66 44.3,13.97 C204.1 44.3,13.92 44.02,13.64 44.02,12.5 U201.1 | 43.54,14.66 42.32,14.66 41.83,15.14 41.4,15.14 D302.3 | 43.54,14.66 v43.54,15.65
VLIPO  (via drill 0.33)
  Top 0.152: J301.2 47.98,10.44 45.92,12.5 44.04,12.5 42.88,13.66 42.88,14.68 42.39,15.16 v42.39,15.39 41.83,15.95 41.83,17.14 41.94,17.25 41.94,17.78 41.58,18.14 41.12,18.14 40.11,17.12 v40.11,11.38 40.06,11.4 39.29,11.4 v38.35,12.34 | v28.91,8.59 28.27,7.95 28.27,6.6 29.5,5.37 32.06,5.37 U401.49 32.06,2.94 C449.2
  Bottom 0.152: C301.1 40.74,9.58 40.46,9.86 U301.3 40.41,9.93 40.41,11.07 v40.11,11.38 | R302.2 41.91,17.8 42.34,17.37 42.34,17.27 D302.2 42.39,17.2 v42.39,15.39 | v28.91,8.59 32.66,12.34 v38.35,12.34
XTAL1
  Top 0.152: C404.1 41.85,3 40.44,3 C462.2 38.96,2.95 Y401.1 38.94,3.02 38.58,3.38 38.58,5.05 U401.62
XTAL2
  Top 0.152: C461.2 35.81,1.65 37.24,1.65 Y401.3 37.31,1.68 37.41,1.68 38.1,2.36 38.1,3.53 38.08,3.56 38.08,5.05 U401.61

### Text on the board
tPlace: 3V3 | SDA | SCL | BSL | RX0 | TX0 | GND | VBUS | On | Baro | 9DoF | Boot | Charge | USB | Reset | HighAcc | stkwans.blogspot.com
bPlace: VBUS | 3V3 | SDA | SCL | BSL | RX0 | TX0 | GND | St Kwan's Home for | the Terminally ADD | v1.0 01 Apr 2014 | a division of | Kwan Systems | RocketometerMPU9150